# Altium schematic sheet RN2483_breakout.SchDoc
size A
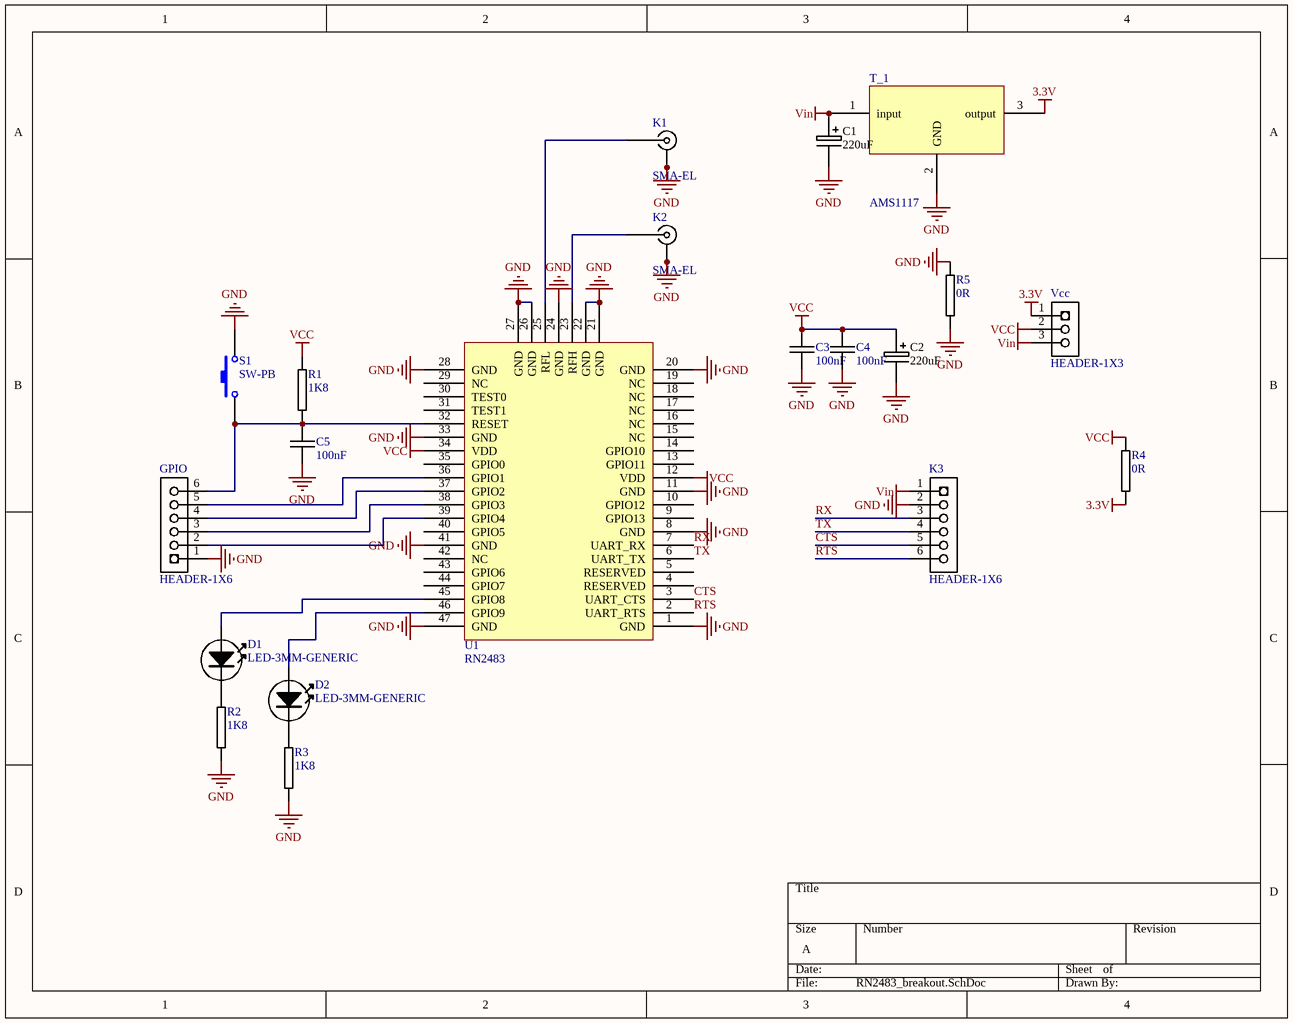
[diagram p0: RN2483_breakout.SchDoc]

## Parts
C1  220uF  [TANTAL_SIZEA]
C2  220uF  [TANTAL_SIZEA]
C3  100nF  [0805C-GENERIC]
C4  100nF  [0805C-GENERIC]
C5  100nF  [0805C-GENERIC]
D1  LED-3MM-GENERIC  [0805R-GENERIC]
D2  LED-3MM-GENERIC  [0805R-GENERIC]
GPIO  HEADER-1X6  [HEADER-1X6]
K1  SMA-EL  [SMA-ENDLAUNCH]
K2  SMA-EL  [SMA-ENDLAUNCH]
K3  HEADER-1X6  [HEADER-1X6]
R1  1K8  [0805R-1K8]
R2  1K8  [0805R-1K8]
R3  1K8  [0805R-1K8]
R4  0R  [0805R-GENERIC]
R5  0R  [0805R-GENERIC]
S1  SW-PB  [SW]
T_1  AMS1117  [SOT-223B_M]
U1  RN2483  [RN2483]
Vcc  HEADER-1X3  [HEADER-1X3]

## Nets
3.3V: R4.2 T_1.3(output) Vcc.1
GND: C1.- C2.- C3.2 C4.2 C5.2 GPIO.1 K1.2 K1.3 K1.4 K1.5 K2.2 K2.3 K2.4 K2.5 K3.2 R2.2 R3.2 R5.1 R5.2 S1.2 T_1.2(GND) U1.1(GND) U1.8(GND) U1.11(GND) U1.20(GND) U1.21(GND) U1.22(GND) U1.24(GND) U1.26(GND) U1.27(GND) U1.28(GND) U1.33(GND) U1.41(GND) U1.47(GND)
VCC: C2.+ C3.1 C4.1 R1.1 R4.1 U1.12(VDD) U1.34(VDD) Vcc.2
Vin: C1.+ K3.1 T_1.1(input) Vcc.3
CTS: K3.5 U1.3(UART_CTS)
RTS: K3.6 U1.2(UART_RTS)
RX: K3.3 U1.7(UART_RX)
TX: K3.4 U1.6(UART_TX)
NetC5_1: C5.1 GPIO.6 R1.2 S1.1 U1.32(RESET)
NetD1_A: D1.A U1.45(GPIO8)
NetD1_K: D1.K R2.1
NetD2_A: D2.A U1.46(GPIO9)
NetD2_K: D2.K R3.1
NetGPIO_2: GPIO.2 U1.39(GPIO4)
NetGPIO_3: GPIO.3 U1.38(GPIO3)
NetGPIO_4: GPIO.4 U1.37(GPIO2)
NetGPIO_5: GPIO.5 U1.36(GPIO1)
NetK1_1: K1.1 U1.25(RFL)
NetK2_1: K2.1 U1.23(RFH)

Not connected (* = marked no-connect by the designer): U1 4(RESERVED) 5(RESERVED) 9(GPIO13) 10(GPIO12) 13(GPIO11) 14(GPIO10) 15(NC) 16(NC) 17(NC) 18(NC) 19(NC) 29(NC) 30(TEST0) 31(TEST1) 35(GPIO0) 40(GPIO5) 42(NC) 43(GPIO6) 44(GPIO7)

## Library data of the parts
C1 C2 = 220UF-5MM: CAPACITOR POLARISED
C3-C5 = 0805C-10UF-6V3-X5R-PAN: CAPACITOR 0805 CERAMIC; Manufacturer: Panasonic - ECG; Manufacturer Part Number: ECJ-2FB0J106M; Reel: C1; Capacitance: 10µF; Voltage - Rated: 6.3V; Temperature Coefficient: X5R; Tolerance: ±20%; Supplier 1: Digi-Key; Supplier Part Number 1: PCC2225TR-ND; Supplier: Digi-Key; Operating Temperature: -55°C ~ 85°C; Mounting Type: Surface Mount, MLCC; Lead Spacing: -; RoHS: RoHS Compliant; Packaging: Tape & Reel (TR); Thickness: 1.25mm; Package / Case: 0805 (2012 metric); Features: General Purpose; Category: Capacitors; Supplier Part Number: PCC2225TR-ND
D1 D2 = LED-3MM-GENERIC: GENERIC LED 3MM; pin to pad: A>1 K>2
K1 K2 = SMA-EL: SMA THREADED RF CONNECTOR VERTICAL
R1-R3 = 0805R-1K8: RESISTOR 0805 1/4 WATT THIN FILM; Reel: *
R4 R5 = 0805R-0R: RESISTOR 0805 1 WATT
S1 = SW-PB: Switch; Published: 24-Mar-1999; LatestRevisionDate: 17-Jul-2002; LatestRevisionNote: Re-released for DXP Platform.; PackageReference: SPST-2; Publisher: Altium Limited; PackageDescription: Switch; 2 Leads
T_1 = LM7815: Voltage Regulator; pin to pad: 1>2 2>1
U1 = RN2483: RN2483 - Microchip
GPIO K3 = HEADER-1X6: Supplier 1: Digi-Key; Supplier Part Number 1: S1011E-36-ND
Vcc = HEADER-1X3: Supplier 1: Digi-Key; Supplier Part Number 1: S1011E-36-ND